# EAGLE design gamma (EAGLE 9.6.2)
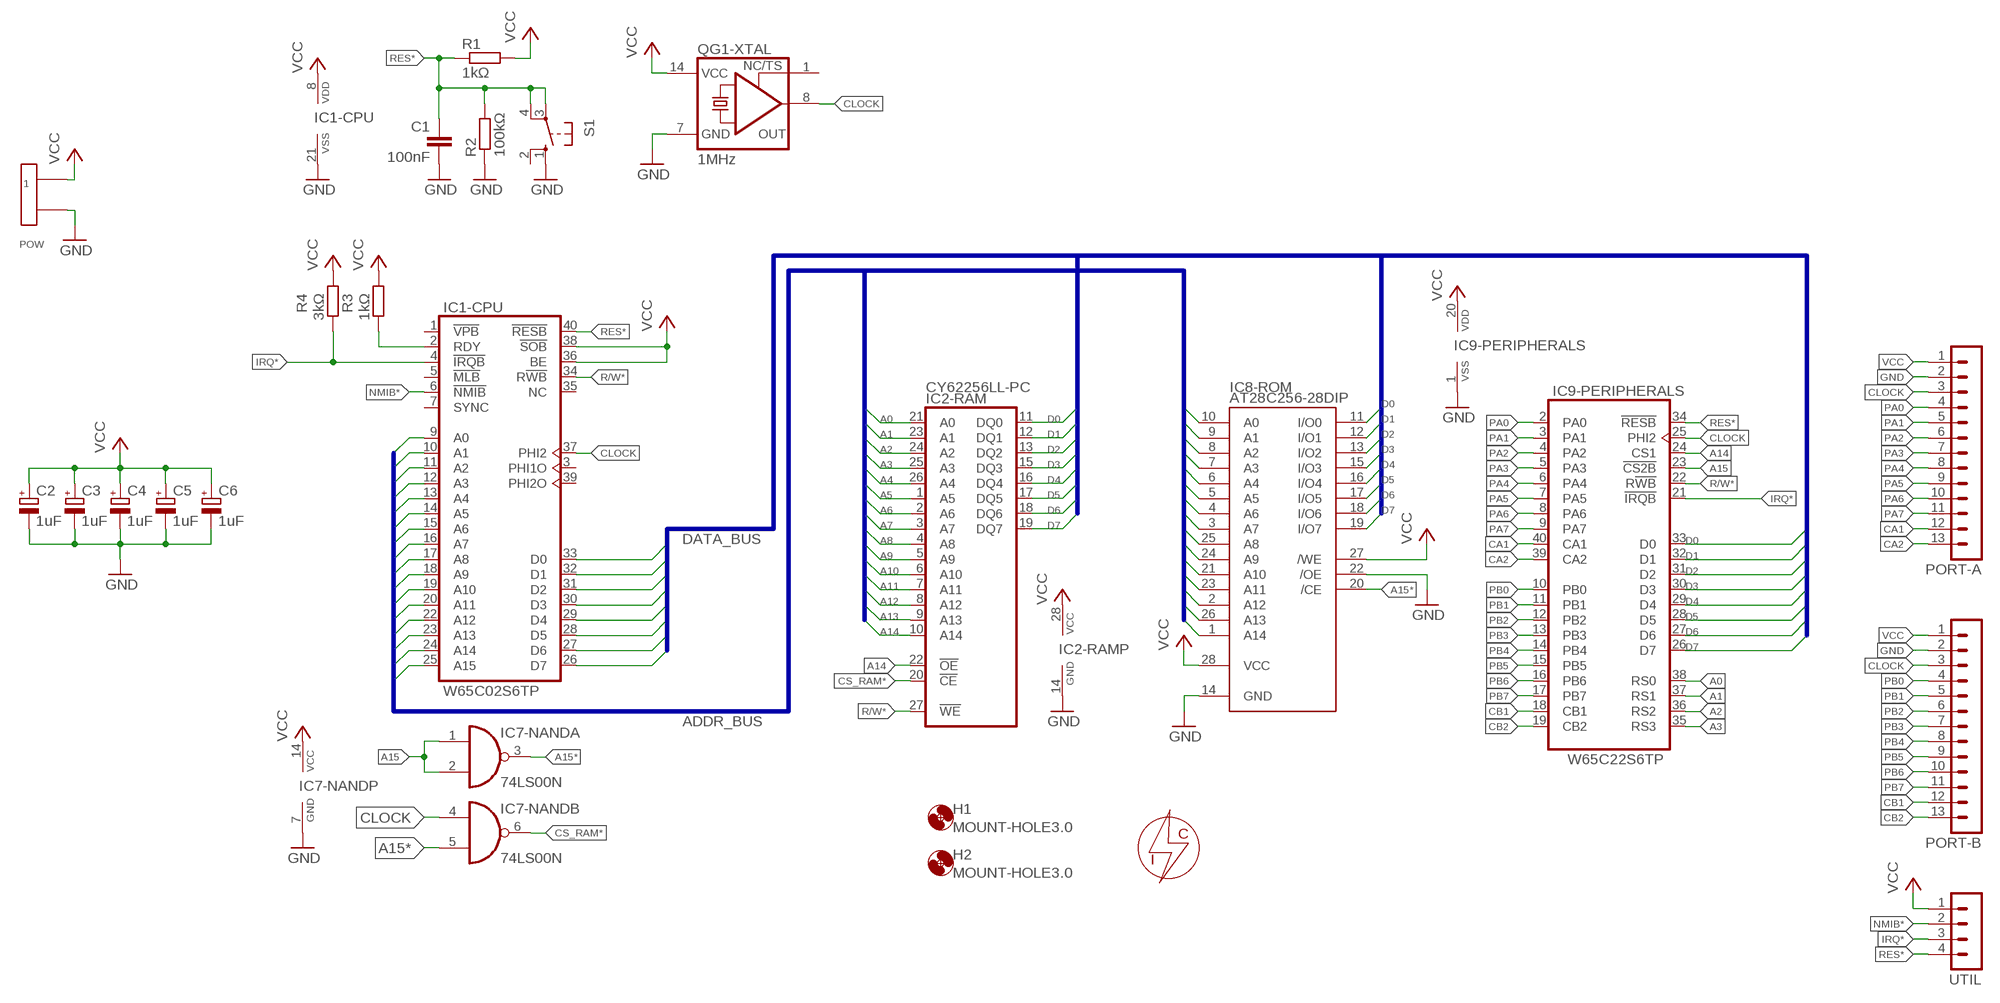
[diagram p0: schematic, sheet 1]

## Parts
C1  100nF  C-EU050-025X075  [C050-025X075]
C2  1uF  CPOL-EUE2-5  [E2-5]
C3  1uF  CPOL-EUE2-5  [E2-5]
C4  1uF  CPOL-EUE2-5  [E2-5]
C5  1uF  CPOL-EUE2-5  [E2-5]
C6  1uF  CPOL-EUE2-5  [E2-5]
H1  MOUNT-HOLE3.0  [3,0]
H2  MOUNT-HOLE3.0  [3,0]
IC1-CPU  W65C02S6TP  [DIL40]
IC2-RAM  CY62256LL-PC  [DIL28-6]
IC7-NAND  74LS00N  [DIL14]
IC8-ROM  AT28C256-28DIP  [DIL28-6]
IC9-PERIPHERALS  W65C22S6TP  [DIL40]
PORT-A  MA13-1  [MA13-1]
PORT-B  MA13-1  [MA13-1]
POW  AK500  [AK500-2]
QG1-XTAL  1MHz  XO-14  [DIL14S]
R1  1kΩ  R-EU_0207/10  [0207/10]
R2  100kΩ  R-EU_0207/10  [0207/10]
R3  1kΩ  R-EU_0207/10  [0207/10]
R4  3kΩ  R-EU_0207/10  [0207/10]
S1  10-XX  [B3F-10XX]
U$1  LOGO-CYBERINDUSTRIES"  [LOGO-SMALL]
UTIL  MA04-1  [MA04-1]

## Nets
A0: IC1-CPU.9(1:A0) IC2-RAM.21(A0) IC8-ROM.10(A0) IC9-PERIPHERALS.38(VIA:RS0)
A1: IC1-CPU.10(1:A1) IC2-RAM.23(A1) IC8-ROM.9(A1) IC9-PERIPHERALS.37(VIA:RS1)
A2: IC1-CPU.11(1:A2) IC2-RAM.24(A2) IC8-ROM.8(A2) IC9-PERIPHERALS.36(VIA:RS2)
A3: IC1-CPU.12(1:A3) IC2-RAM.25(A3) IC8-ROM.7(A3) IC9-PERIPHERALS.35(VIA:RS3)
A4: IC1-CPU.13(1:A4) IC2-RAM.26(A4) IC8-ROM.6(A4)
A5: IC1-CPU.14(1:A5) IC2-RAM.1(A5) IC8-ROM.5(A5)
A6: IC1-CPU.15(1:A6) IC2-RAM.2(A6) IC8-ROM.4(A6)
A7: IC1-CPU.16(1:A7) IC2-RAM.3(A7) IC8-ROM.3(A7)
A8: IC1-CPU.17(1:A8) IC2-RAM.4(A8) IC8-ROM.25(A8)
A9: IC1-CPU.18(1:A9) IC2-RAM.5(A9) IC8-ROM.24(A9)
A10: IC1-CPU.19(1:A10) IC2-RAM.6(A10) IC8-ROM.21(A10)
A11: IC1-CPU.20(1:A11) IC2-RAM.7(A11) IC8-ROM.23(A11)
A12: IC1-CPU.22(1:A12) IC2-RAM.8(A12) IC8-ROM.2(A12)
A13: IC1-CPU.23(1:A13) IC2-RAM.9(A13) IC8-ROM.26(A13)
A14: IC1-CPU.24(1:A14) IC2-RAM.10(A14) IC2-RAM.22(!OE) IC8-ROM.1(A14) IC9-PERIPHERALS.24(VIA:CS1)
A15: IC1-CPU.25(1:A15) IC7-NAND.1(A:I0) IC7-NAND.2(A:I1) IC9-PERIPHERALS.23(VIA:!CS2B)
A15*: IC7-NAND.3(A:O) IC7-NAND.5(B:I1) IC8-ROM.20(/CE)
CA1: IC9-PERIPHERALS.40(VIA:CA1) PORT-A.12
CA2: IC9-PERIPHERALS.39(VIA:CA2) PORT-A.13
CB1: IC9-PERIPHERALS.18(VIA:CB1) PORT-B.12
CB2: IC9-PERIPHERALS.19(VIA:CB2) PORT-B.13
CLOCK: IC1-CPU.37(1:PHI2) IC7-NAND.4(B:I0) IC9-PERIPHERALS.25(VIA:PHI2) PORT-A.3 PORT-B.3 QG1-XTAL.8(OUT)
CS_RAM*: IC2-RAM.20(!CE) IC7-NAND.6(B:O)
D0: IC1-CPU.33(1:D0) IC2-RAM.11(DQ0) IC8-ROM.11(I/O0) IC9-PERIPHERALS.33(VIA:D0)
D1: IC1-CPU.32(1:D1) IC2-RAM.12(DQ1) IC8-ROM.12(I/O1) IC9-PERIPHERALS.32(VIA:D1)
D2: IC1-CPU.31(1:D2) IC2-RAM.13(DQ2) IC8-ROM.13(I/O2) IC9-PERIPHERALS.31(VIA:D2)
D3: IC1-CPU.30(1:D3) IC2-RAM.15(DQ3) IC8-ROM.15(I/O3) IC9-PERIPHERALS.30(VIA:D3)
D4: IC1-CPU.29(1:D4) IC2-RAM.16(DQ4) IC8-ROM.16(I/O4) IC9-PERIPHERALS.29(VIA:D4)
D5: IC1-CPU.28(1:D5) IC2-RAM.17(DQ5) IC8-ROM.17(I/O5) IC9-PERIPHERALS.28(VIA:D5)
D6: IC1-CPU.27(1:D6) IC2-RAM.18(DQ6) IC8-ROM.18(I/O6) IC9-PERIPHERALS.27(VIA:D6)
D7: IC1-CPU.26(1:D7) IC2-RAM.19(DQ7) IC8-ROM.19(I/O7) IC9-PERIPHERALS.26(VIA:D7)
GND: C1.2 C2.- C3.- C4.- C5.- C6.- IC1-CPU.21(P:VSS) IC2-RAM.14(GND) IC7-NAND.7(P:GND) IC8-ROM.14(GND) IC8-ROM.22(/OE) IC9-PERIPHERALS.1(VIAP:VSS) PORT-A.2 PORT-B.2 POW.P$2 QG1-XTAL.7(GND) R2.1 S1.1(S)
IRQ*: IC1-CPU.4(1:!IRQB) IC9-PERIPHERALS.21(VIA:!IRQB) R4.2 UTIL.3
N$1: IC1-CPU.2(1:RDY) R3.2
NMIB*: IC1-CPU.6(1:!NMIB) UTIL.2
PA0: IC9-PERIPHERALS.2(VIA:PA0) PORT-A.4
PA1: IC9-PERIPHERALS.3(VIA:PA1) PORT-A.5
PA2: IC9-PERIPHERALS.4(VIA:PA2) PORT-A.6
PA3: IC9-PERIPHERALS.5(VIA:PA3) PORT-A.7
PA4: IC9-PERIPHERALS.6(VIA:PA4) PORT-A.8
PA5: IC9-PERIPHERALS.7(VIA:PA5) PORT-A.9
PA6: IC9-PERIPHERALS.8(VIA:PA6) PORT-A.10
PA7: IC9-PERIPHERALS.9(VIA:PA7) PORT-A.11
PB0: IC9-PERIPHERALS.10(VIA:PB0) PORT-B.4
PB1: IC9-PERIPHERALS.11(VIA:PB1) PORT-B.5
PB2: IC9-PERIPHERALS.12(VIA:PB2) PORT-B.6
PB3: IC9-PERIPHERALS.13(VIA:PB3) PORT-B.7
PB4: IC9-PERIPHERALS.14(VIA:PB4) PORT-B.8
PB5: IC9-PERIPHERALS.15(VIA:PB5) PORT-B.9
PB6: IC9-PERIPHERALS.16(VIA:PB6) PORT-B.10
PB7: IC9-PERIPHERALS.17(VIA:PB7) PORT-B.11
R/W*: IC1-CPU.34(1:R!WB) IC2-RAM.27(!WE) IC9-PERIPHERALS.22(VIA:R!WB)
RES*: C1.1 IC1-CPU.40(1:!RESB) IC9-PERIPHERALS.34(VIA:!RESB) R1.1 R2.2 S1.3(P) S1.4(P1) UTIL.4
VCC: C2.+ C3.+ C4.+ C5.+ C6.+ IC1-CPU.8(P:VDD) IC1-CPU.36(1:BE) IC1-CPU.38(1:!SOB) IC2-RAM.28(VCC) IC7-NAND.14(P:VCC) IC8-ROM.27(/WE) IC8-ROM.28(VCC) IC9-PERIPHERALS.20(VIAP:VDD) PORT-A.1 PORT-B.1 POW.P$1 QG1-XTAL.14(VCC) R1.2 R3.1 R4.1 UTIL.1
Unconnected: IC1-CPU.1(1:!VPB) IC1-CPU.3(1:PHI1O) IC1-CPU.5(1:!MLB) IC1-CPU.7(1:SYNC) IC1-CPU.35(1:NC) IC1-CPU.39(1:PHI2O) IC7-NAND.8(C:O) IC7-NAND.9(C:I0) IC7-NAND.10(C:I1) IC7-NAND.11(D:O) IC7-NAND.12(D:I0) IC7-NAND.13(D:I1) QG1-XTAL.1(TS) S1.2(S1)

## Buses
D0,D1,D2,D3,D4,D5,D6,D7
ADDR_BUS:A0,A1,A2,A3,A4,A5,A6,A7,A8,A9,A10,A11,A12,A13,A14,A15

## Notes on the sheet
- DATA_BUS
- ADDR_BUS

## Library data of the parts
C1 = rcl:C-EU: CAPACITOR, European symbol; SPICEPREFIX: C
C2-C6 = ITIS:CPOL-EU: POLARIZED CAPACITOR, European symbol
H1 H2 = ITIS:MOUNT-HOLE: MOUNTING HOLE with drill center marker
IC1-CPU = 6502:W65C02S: W65C02 by WDC
IC2-RAM = memory-sram:CY62256LL-?*: 256K (32K x 8) CMOS-Static RAM Source: http://download.cypress.com.edgesuite.net/design_resources/datasheets/contents/cy62256_8.pdf
IC7-NAND = 74xx-eu:74*00: Quad 2-input NAND gate
IC8-ROM = atmel-custom:AT28C256-28DIP: IC EEPROM 256KBIT 150NS 28DIP
IC9-PERIPHERALS = 6502:W65C22S: W65C22 by WDC
PORT-A PORT-B = con-lstb:MA13-1: PIN HEADER; OC_FARNELL: unknown; OC_NEWARK: unknown
POW = CiniTechLibrary:AK500
QG1-XTAL = crystal:XO-: CRYSTAL; OC_FARNELL: unknown; OC_NEWARK: unknown
R1-R4 = rcl:R-EU_: RESISTOR, European symbol; SPICEPREFIX: R
S1 = switch-omron:10-XX: OMRON SWITCH; MPN: B3F-1000; OC_FARNELL: 176432; OC_NEWARK: 36M3542
U$1 = CyberLibrary:LOGO-CYBERINDUSTRIES
UTIL = con-lstb:MA04-1: PIN HEADER; OC_FARNELL: unknown; OC_NEWARK: unknown

## Board
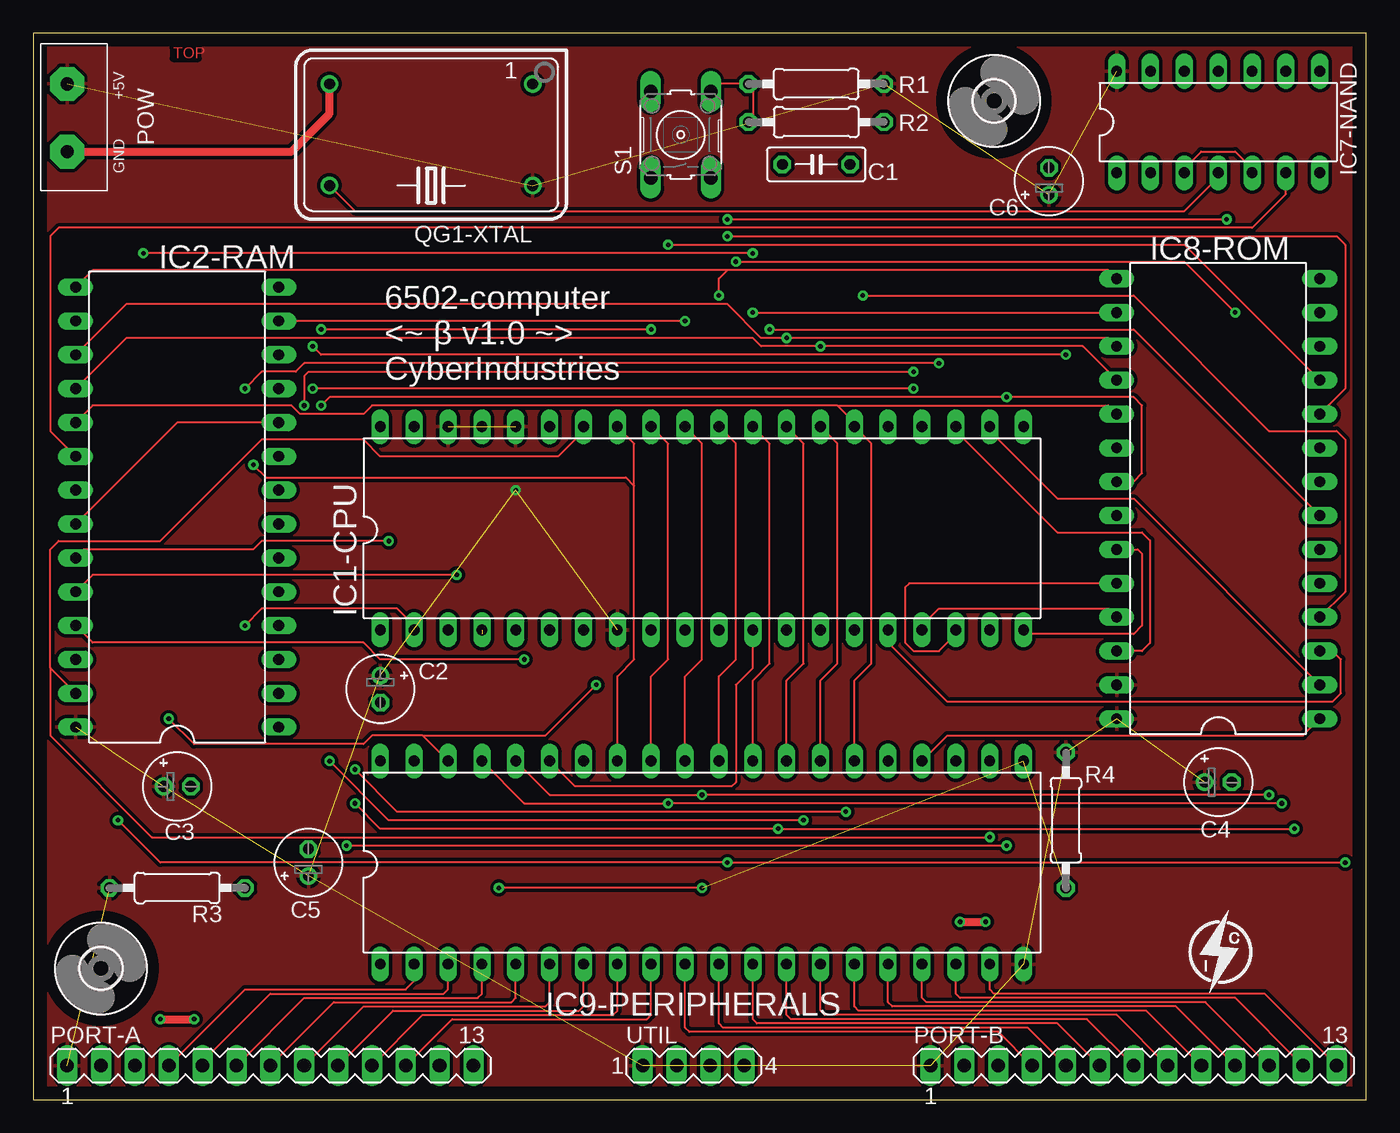
[diagram p1: board, top side]
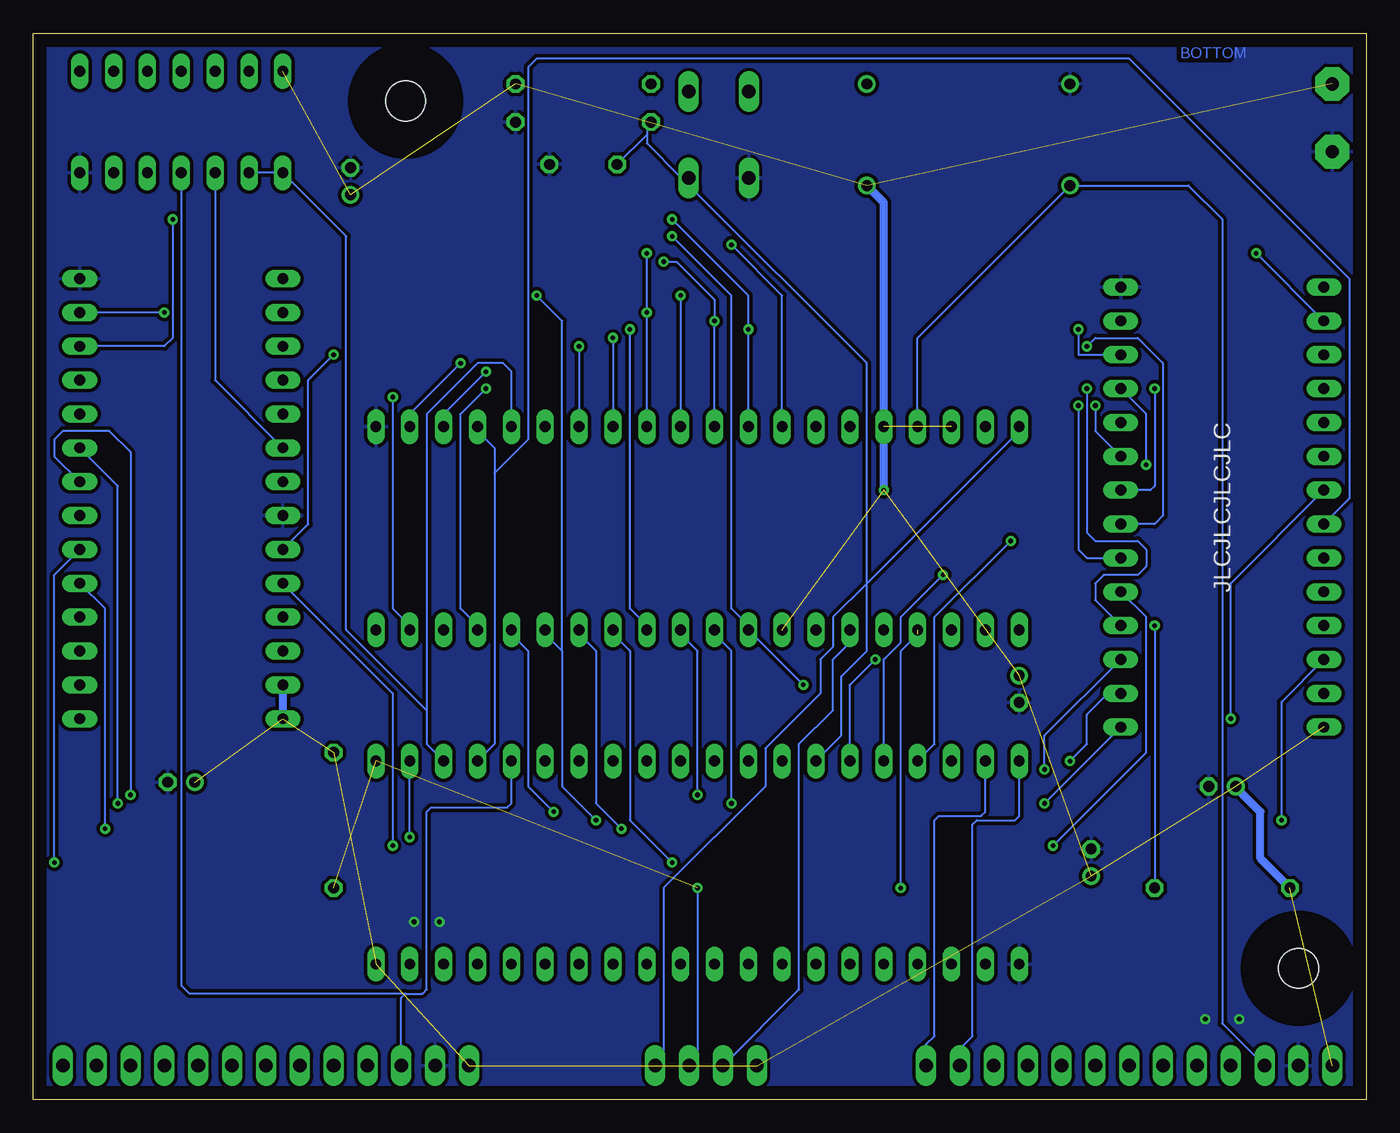
[diagram p2: board, bottom side, seen from below]

Size 100 x 80 mm. Coordinates in mm from the lower left corner, seen from the top.
Outline: 0,0 100,0 100,80 0,80 0,0
Copper layers (1*16): Top 0.035mm / dielectric 1.5mm / Bottom 0.035mm
Design rules "default": minimum track width 6mil, minimum drill 0.35mm, track to track 6mil, track to pad 6mil, pad to pad 6mil, via to via 6mil, smd to smd 6mil, copper to edge 40mil, drill to drill 6mil, minimum pad ring 10mil, minimum via ring 8mil, stop-mask expansion 4mil, vias tented up to drill 0mil, thermal gap 10mil

### Footprints (pad centres in the part's own frame; a part is rotated, then mirrored left to right if it is on the bottom)
C050-025X075 = drill 0.813 octagon: 1 -2.54,0; 2 2.54,0
E2-5 = drill 0.813 pad 1.27: + -1.016,0 | drill 0.813 pad 1.27 octagon: - 1.016,0
3,0 = hole 3: 0,0
DIL40 = drill 0.813 long: 1 -24.13,-7.62; 2 -21.59,-7.62; 3 -19.05,-7.62; 4 -16.51,-7.62; 5 -13.97,-7.62; 6 -11.43,-7.62; 7 -8.89,-7.62; 8 -6.35,-7.62; 9 -3.81,-7.62; 10 -1.27,-7.62; 11 1.27,-7.62; 12 3.81,-7.62; 13 6.35,-7.62; 14 8.89,-7.62; 15 11.43,-7.62; 16 13.97,-7.62; 17 16.51,-7.62; 18 19.05,-7.62; 19 21.59,-7.62; 20 24.13,-7.62; 21 24.13,7.62; 22 21.59,7.62; 23 19.05,7.62; 24 16.51,7.62; 25 13.97,7.62; 26 11.43,7.62; 27 8.89,7.62; 28 6.35,7.62; 29 3.81,7.62; 30 1.27,7.62; 31 -1.27,7.62; 32 -3.81,7.62; 33 -6.35,7.62; 34 -8.89,7.62; 35 -11.43,7.62; 36 -13.97,7.62; 37 -16.51,7.62; 38 -19.05,7.62; 39 -21.59,7.62; 40 -24.13,7.62
DIL28-6 = drill 0.813 long: 1 -16.51,-7.62; 2 -13.97,-7.62; 3 -11.43,-7.62; 4 -8.89,-7.62; 5 -6.35,-7.62; 6 -3.81,-7.62; 7 -1.27,-7.62; 8 1.27,-7.62; 9 3.81,-7.62; 10 6.35,-7.62; 11 8.89,-7.62; 12 11.43,-7.62; 13 13.97,-7.62; 14 16.51,-7.62; 15 16.51,7.62; 16 13.97,7.62; 17 11.43,7.62; 18 8.89,7.62; 19 6.35,7.62; 20 3.81,7.62; 21 1.27,7.62; 22 -1.27,7.62; 23 -3.81,7.62; 24 -6.35,7.62; 25 -8.89,7.62; 26 -11.43,7.62; 27 -13.97,7.62; 28 -16.51,7.62
DIL14 = drill 0.813 long: 1 -7.62,-3.81; 2 -5.08,-3.81; 3 -2.54,-3.81; 4 0,-3.81; 5 2.54,-3.81; 6 5.08,-3.81; 7 7.62,-3.81; 8 7.62,3.81; 9 5.08,3.81; 10 2.54,3.81; 11 0,3.81; 12 -2.54,3.81; 13 -5.08,3.81; 14 -7.62,3.81
MA13-1 = drill 1.016 long: 1 -15.24,0; 2 -12.7,0; 3 -10.16,0; 4 -7.62,0; 5 -5.08,0; 6 -2.54,0; 7 0,0; 8 2.54,0; 9 5.08,0; 10 7.62,0; 11 10.16,0; 12 12.7,0; 13 15.24,0
AK500-2 = drill 1 pad 2.54 octagon: P$1 0,0; P$2 5.08,0
DIL14S = drill 0.813: 1 -7.62,-3.81; 7 7.62,-3.81; 8 7.62,3.81; 14 -7.62,3.81
0207/10 = drill 0.813 octagon: 1 -5.08,0; 2 5.08,0
B3F-10XX = drill 1.016 long: 1 -3.251,2.261; 2 3.251,2.261; 3 -3.251,-2.261; 4 3.251,-2.261
MA04-1 = drill 1.016 long: 1 -3.81,0; 2 -1.27,0; 3 1.27,0; 4 3.81,0

### Placement (x,y rotation side)
C1  58.74,70.17 0 top
C2  26.04,30.8 270 top
C3  10.79,23.5 0 top
C4  88.9,23.81 0 top
C5  20.64,17.78 90 top
C6  76.2,68.9 90 top
H1  5.08,9.84 0 top
H2  72.07,74.93 0 top
IC1-CPU  50.16,42.86 0 top
IC2-RAM  10.79,44.45 90 top
IC7-NAND  88.9,73.34 0 top
IC8-ROM  88.9,45.09 90 top
IC9-PERIPHERALS  50.16,17.78 0 top
PORT-A  17.78,2.54 0 top
PORT-B  82.55,2.54 0 top
POW  2.54,76.2 270 top
QG1-XTAL  29.84,72.39 180 top
R1  58.74,76.2 0 top
R2  58.74,73.34 180 top
R3  10.79,15.88 0 top
R4  77.47,20.95 270 top
S1  48.58,72.39 90 top
U$1  86.68,7.94 0 top
UTIL  49.53,2.54 0 top

### Tracks (layer width: path | path; a pad name or v marks a point on that pad's centre or on a via)
A0  (via drill 0.35)
  Top 0.152: v10.16,28.57 12.06,26.67 24.77,26.67 25.4,27.3 29.21,27.3 | IC9-PERIPHERALS.38 29.21,27.3 | v42.23,31.11 38.42,27.3 29.21,27.3 | IC8-ROM.10 98.42,53.34 98.42,64.14 97.79,64.77 v52.07,64.77
  Bottom 0.152: IC2-RAM.21 10.16,38.73 v10.16,28.57 | v42.23,31.11 IC1-CPU.9 46.35,35.56 47.62,36.83 47.62,60.33 v52.07,64.77
A1  (via drill 0.35)
  Top 0.152: IC2-RAM.23 3.81,41.27 16.51,41.27 17.14,41.91 v26.67,41.91 | IC9-PERIPHERALS.37 36.83,22.23 v47.62,22.23 v93.66,22.23
  Bottom 0.152: v26.67,41.91 32.38,36.2 32.38,26.67 IC9-PERIPHERALS.37 | v47.62,22.23 47.62,33.66 48.9,34.92 IC1-CPU.10 | IC8-ROM.9 93.66,46.04 v93.66,22.23
A2  (via drill 0.35)
  Top 0.152: IC2-RAM.24 4.45,39.37 v31.75,39.37 | IC9-PERIPHERALS.36 38.73,22.86 v50.16,22.86 v92.71,22.86
  Bottom 0.152: v31.75,39.37 34.92,36.2 34.92,34.29 36.2,33.02 IC9-PERIPHERALS.36 | v50.16,22.86 50.16,33.66 51.44,34.92 IC1-CPU.11 | IC8-ROM.8 98.42,48.26 98.42,49.53 97.79,50.16 94.3,50.16 92.71,48.58 v92.71,22.86
A3  (via drill 0.35)
  Top 0.152: IC2-RAM.25 4.45,34.29 24.77,34.29 26.04,33.02 v36.83,33.02 | IC1-CPU.12 53.98,32.38 52.7,31.11 52.7,23.81 52.39,23.5 40.64,23.5 IC9-PERIPHERALS.35 | IC8-ROM.7 82.55,57.78 v55.24,57.78
  Bottom 0.152: v36.83,33.02 38.73,31.11 IC9-PERIPHERALS.35 | v55.24,57.78 55.24,36.83 53.98,35.56 IC1-CPU.12
A4  (via drill 0.35)
  Top 0.152: v6.35,20.95 9.53,17.78 v52.07,17.78 v98.42,17.78
  Bottom 0.152: IC2-RAM.26 6.35,29.84 v6.35,20.95 | v52.07,17.78 55.24,20.95 55.24,33.66 56.52,34.92 IC1-CPU.13 | IC8-ROM.6 98.42,39.37 v98.42,17.78
A5  (via drill 0.35)
  Top 0.152: v24.13,22.23 26.04,20.32 v55.88,20.32 v94.61,20.32
  Bottom 0.152: v24.13,22.23 IC2-RAM.1 | v55.88,20.32 57.78,22.23 57.78,33.66 59.05,34.92 IC1-CPU.14 | IC8-ROM.5 94.61,36.83 v94.61,20.32
A6  (via drill 0.35)
  Top 0.152: v22.23,25.4 26.67,20.95 v57.78,20.95 | IC8-ROM.4 98.42,38.1 98.42,49.53 97.79,50.16 92.71,50.16 82.55,60.33 v62.23,60.33
  Bottom 0.152: v57.78,20.95 60.33,23.5 60.33,33.66 | 60.33,33.66 61.59,34.92 IC1-CPU.15 | v62.23,60.33 60.33,58.42 60.33,33.66 | v22.23,25.4 20.95,26.67 20.95,28.89 19.37,30.48 IC2-RAM.2
A7  (via drill 0.35)
  Top 0.152: v24.13,24.77 27.3,21.59 v60.96,21.59 | IC1-CPU.16 64.14,34.29 68.58,29.84 97.47,29.84 98.11,30.48 98.11,33.02 97.47,33.66 IC8-ROM.3
  Bottom 0.152: IC2-RAM.3 24.13,27.3 v24.13,24.77 | v60.96,21.59 62.87,23.5 62.87,33.66 64.14,34.92 IC1-CPU.16
A8  (via drill 0.35)
  Top 0.152: v66.04,53.34 v20.95,53.34 | IC8-ROM.25 80.64,36.83 67.94,36.83 66.67,35.56 IC1-CPU.17
  Bottom 0.152: IC2-RAM.4 20.32,37.47 20.32,38.73 19.68,39.37 17.14,39.37 16.51,40.01 16.51,41.27 17.14,41.91 20.32,41.91 20.95,42.55 v20.95,53.34 | v66.04,53.34 67.94,51.44 67.94,36.83 66.67,35.56 IC1-CPU.17
A9  (via drill 0.35)
  Top 0.152: v73.03,19.05 v23.5,19.05 | IC8-ROM.24 65.72,38.73 65.41,38.42 65.41,34.29 66.04,33.66 67.94,33.66 69.22,34.92 IC1-CPU.18
  Bottom 0.152: IC2-RAM.5 16.51,36.2 16.51,26.04 v23.5,19.05 | v73.03,19.05 73.03,30.48 IC8-ROM.24
A10  (via drill 0.35)
  Top 0.152: v21.59,52.07 22.23,52.7 v73.03,52.7 82.55,52.7 83.19,52.07 83.19,46.99 82.55,46.35 IC8-ROM.21
  Bottom 0.152: IC2-RAM.6 20.95,40.64 21.59,41.27 v21.59,52.07 | v73.03,52.7 73.03,36.83 71.75,35.56 IC1-CPU.19
A11  (via drill 0.35)
  Top 0.152: v20.95,56.52 21.59,55.88 v77.47,55.88 | IC8-ROM.23 82.87,41.27 83.19,40.96 83.19,35.56 82.55,34.92 74.3,34.92 IC1-CPU.20
  Bottom 0.152: v20.95,56.52 20.32,57.15 17.14,57.15 15.24,55.24 15.24,43.81 15.88,43.18 IC2-RAM.7 | v77.47,55.88 79.38,53.98 79.38,43.18 IC8-ROM.23
A12  (via drill 0.35)
  Top 0.152: v15.88,53.34 17.14,54.61 19.68,54.61 20.32,55.24 v67.94,55.24 | IC8-ROM.2 82.55,45.09 76.83,45.09 71.75,50.16 IC1-CPU.22
  Bottom 0.152: IC2-RAM.8 16.19,45.72 15.88,46.04 v15.88,53.34 | v67.94,55.24 71.75,51.44 IC1-CPU.22
A13  (via drill 0.35)
  Top 0.152: v20.32,52.07 20.32,54.29 20.64,54.61 v66.04,54.61 | IC8-ROM.26 83.19,33.66 83.78,34.25 83.78,41.95 83.19,42.55 76.83,42.55 69.22,50.16 IC1-CPU.23
  Bottom 0.152: IC2-RAM.9 20.32,50.16 v20.32,52.07 | v66.04,54.61 69.22,51.44 IC1-CPU.23
A14
  Top 0.152: IC2-RAM.22 10.79,50.8 IC2-RAM.10 | IC8-ROM.1 95.25,27.3 68.58,27.3 IC9-PERIPHERALS.24
  Bottom 0.152: IC9-PERIPHERALS.24 65.41,26.67 65.41,46.99 | 65.41,46.99 65.41,48.9 66.67,50.16 IC1-CPU.24 | IC2-RAM.22 1.27,45.09 1.27,61.59 17.78,78.11 62.23,78.11 62.87,77.47 62.87,49.53 65.41,46.99
A15
  Bottom 0.152: IC9-PERIPHERALS.23 70.48,26.67 70.48,29.21 | 70.48,29.21 70.48,51.44 66.67,55.24 64.77,55.24 64.14,54.61 IC1-CPU.25 | 70.48,29.21 76.52,35.24 76.52,64.77 IC7-NAND.1 IC7-NAND.2
A15*
  Top 0.152: IC7-NAND.5 91.44,69.85 90.17,71.12 87.63,71.12 86.36,69.85 IC7-NAND.3
  Bottom 0.152: IC8-ROM.20 86.36,53.98 IC7-NAND.3
CA1
  Bottom 0.152: PORT-A.12 30.48,3.81 29.53,4.76 29.53,20.64 29.21,20.95 26.35,20.95 26.04,21.27 IC9-PERIPHERALS.40
CA2
  Bottom 0.152: PORT-A.13 33.02,4.13 32.38,4.76 32.38,20.95 32.07,21.27 28.89,21.27 28.57,21.59 IC9-PERIPHERALS.39
CB1
  Top 0.152: PORT-B.12 90.17,7.62 69.53,7.62 69.22,7.94 IC9-PERIPHERALS.18
CB2
  Top 0.152: PORT-B.13 92.39,7.94 72.07,7.94 71.75,8.26 IC9-PERIPHERALS.19
CLOCK
  Top 0.152: QG1-XTAL.8 24.13,66.67 86.36,66.67 88.9,69.22 IC7-NAND.4
  Bottom 0.152: PORT-B.3 72.39,7.62 72.07,7.94 | IC9-PERIPHERALS.25 64.14,22.23 64.45,21.91 70.17,21.91 70.48,21.59 70.48,8.26 70.8,7.94 72.07,7.94 | IC1-CPU.37 33.66,57.15 QG1-XTAL.8 13.34,68.58 10.79,66.04 10.79,5.71 PORT-A.3 | IC7-NAND.4 88.9,8.57 88.27,7.94 72.07,7.94
CS_RAM*
  Top 0.152: IC2-RAM.20 1.27,50.16 1.27,64.77 1.91,65.41 91.44,65.41 93.98,67.94 IC7-NAND.6
D0  (via drill 0.35)
  Top 0.152: IC9-PERIPHERALS.33 43.81,31.75 45.09,33.02 45.09,46.04 | 45.09,46.04 45.09,49.21 IC1-CPU.33 | IC8-ROM.11 86.36,64.14 v47.62,64.14 | 45.09,46.04 44.45,46.67 17.46,46.67 v16.51,47.62
  Bottom 0.152: IC2-RAM.11 16.51,51.44 v16.51,47.62 | v47.62,64.14 43.81,60.33 IC1-CPU.33
D1  (via drill 0.35)
  Top 0.152: IC9-PERIPHERALS.32 46.35,31.75 47.62,33.02 47.62,49.21 IC1-CPU.32 | v46.35,57.78 v21.59,57.78 | v52.07,66.04 v89.53,66.04
  Bottom 0.152: IC2-RAM.12 21.59,55.88 v21.59,57.78 | IC1-CPU.32 v46.35,57.78 46.35,60.33 v52.07,66.04 | v89.53,66.04 89.53,57.15 90.17,56.52 IC8-ROM.12
D2  (via drill 0.35)
  Top 0.152: IC9-PERIPHERALS.31 48.9,31.75 50.16,33.02 50.16,49.21 IC1-CPU.31 | v48.9,58.42 IC2-RAM.13 | v90.17,59.05 86.36,62.87 v52.7,62.87
  Bottom 0.152: IC1-CPU.31 v48.9,58.42 48.9,60.01 51.75,62.87 v52.7,62.87 | v90.17,59.05 IC8-ROM.13
D3  (via drill 0.35)
  Top 0.152: IC9-PERIPHERALS.30 51.44,31.75 52.7,33.02 52.7,49.21 IC1-CPU.30 | IC2-RAM.15 4.45,62.23 52.07,62.23 | 52.07,62.23 80.64,62.23 IC8-ROM.15 | v51.44,60.33 51.44,61.59 52.07,62.23
  Bottom 0.152: v51.44,60.33 IC1-CPU.30
D4  (via drill 0.35)
  Top 0.152: IC9-PERIPHERALS.29 53.98,31.43 55.24,32.7 55.24,49.21 IC1-CPU.29 | v53.98,63.5 v8.26,63.5 | v53.98,59.05 IC8-ROM.16
  Bottom 0.152: v8.26,63.5 IC2-RAM.16 | IC1-CPU.29 v53.98,59.05 v53.98,63.5
D5  (via drill 0.35)
  Top 0.152: IC9-PERIPHERALS.28 56.52,31.43 57.78,32.7 57.78,49.21 IC1-CPU.28 | IC2-RAM.17 6.99,59.69 52.07,59.69 54.61,57.15 v56.52,57.15 80.64,57.15 IC8-ROM.17
  Bottom 0.152: v56.52,57.15 IC1-CPU.28
D6  (via drill 0.35)
  Top 0.152: IC9-PERIPHERALS.27 59.05,31.43 60.33,32.7 60.33,49.21 IC1-CPU.27 | IC2-RAM.18 6.99,57.15 53.98,57.15 54.61,56.52 v59.05,56.52 78.74,56.52 IC8-ROM.18
  Bottom 0.152: v59.05,56.52 IC1-CPU.27
D7
  Top 0.152: IC9-PERIPHERALS.26 61.59,31.43 62.87,32.7 62.87,49.21 IC1-CPU.26 61.59,50.8 60.33,52.07 | IC2-RAM.19 4.45,52.07 19.37,52.07 20,51.44 24.77,51.44 25.4,52.07 60.33,52.07 | IC8-ROM.19 80.64,52.07 60.33,52.07
GND  (via drill 0.35)
  Top 0.61: POW.P$2 19.37,71.12 22.23,73.98 QG1-XTAL.7 | v69.53,13.34 v71.44,13.34 | v9.53,6.03 v12.06,6.03
  pour Bottom (isolate 0.254): 106.36,-4.45 -1.91,-4.45 -1.91,80.96 106.36,80.96
IRQ*  (via drill 0.35)  (3 unrouted)
  Top 0.152: v50.16,15.88 v34.92,15.88
  Bottom 0.152: 33.66,34.92 34.92,33.66 v34.92,15.88 | UTIL.3 50.16,3.17 v50.16,15.88
N$1  (via drill 0.35)
  Top 0.152: v15.88,35.56 17.14,36.83 27.3,36.83 28.57,35.56 IC1-CPU.2
  Bottom 0.152: v15.88,35.56 R3.2
NMIB*
  Bottom 0.152: UTIL.2 42.55,8.26 42.55,26.67 40.01,29.21 40.01,33.02 38.73,34.29 IC1-CPU.6
PA0
  Top 0.152: PORT-A.4 15.88,8.26 27.94,8.26 28.57,8.89 IC9-PERIPHERALS.2
PA1
  Top 0.152: PORT-A.5 12.7,2.86 17.78,7.94 30.8,7.94 31.11,8.26 IC9-PERIPHERALS.3
PA2
  Top 0.152: PORT-A.6 20.32,7.62 33.34,7.62 33.66,7.94 IC9-PERIPHERALS.4
PA3
  Top 0.152: PORT-A.7 22.54,7.3 35.88,7.3 36.2,7.62 IC9-PERIPHERALS.5
PA4
  Top 0.152: PORT-A.8 24.77,6.99 38.42,6.99 38.73,7.3 IC9-PERIPHERALS.6
PA5
  Top 0.152: PORT-A.9 26.99,6.67 40.96,6.67 41.27,6.99 IC9-PERIPHERALS.7
PA6
  Top 0.152: PORT-A.10 29.21,6.35 43.5,6.35 43.81,6.67 IC9-PERIPHERALS.8
PA7
  Top 0.152: PORT-A.11 31.43,6.03 46.04,6.03 46.35,6.35 IC9-PERIPHERALS.9
PB0
  Top 0.152: PORT-B.4 72.39,5.08 49.21,5.08 48.9,5.4 IC9-PERIPHERALS.10
PB1
  Top 0.152: PORT-B.5 74.61,5.4 51.75,5.4 51.44,5.71 IC9-PERIPHERALS.11
PB2
  Top 0.152: PORT-B.6 76.83,5.71 54.29,5.71 53.98,6.03 IC9-PERIPHERALS.12
PB3
  Top 0.152: PORT-B.7 79.06,6.03 56.83,6.03 56.52,6.35 IC9-PERIPHERALS.13
PB4
  Top 0.152: PORT-B.8 81.28,6.35 59.37,6.35 59.05,6.67 IC9-PERIPHERALS.14
PB5
  Top 0.152: PORT-B.9 83.5,6.67 61.91,6.67 61.59,6.99 IC9-PERIPHERALS.15
PB6
  Top 0.152: PORT-B.10 85.72,6.99 64.45,6.99 64.14,7.3 IC9-PERIPHERALS.16
PB7
  Top 0.152: PORT-B.11 87.95,7.3 66.99,7.3 66.67,7.62 IC9-PERIPHERALS.17
R/W*  (via drill 0.35)
  Top 0.152: 1.27,32.38 IC2-RAM.27 | 1.27,32.38 1.27,41.27 1.91,41.91 9.53,41.91 17.14,49.53 24.77,49.53 26.04,48.26 39.37,48.26 41.27,50.16 IC1-CPU.34 | v71.75,19.68 8.89,19.68 1.27,27.3 1.27,32.38
  Bottom 0.152: v71.75,19.68 IC9-PERIPHERALS.22
RES*
  Top 0.152: R2.2 53.98,73.66 53.98,76.2 R1.1 51.44,76.2 S1.4
  Bottom 0.152: 53.98,72.39 C1.1 | 53.98,72.39 53.98,73.03 R2.2 | 53.98,72.39 53.98,71.75 51.44,69.22 S1.3 50.8,68.58 37.47,55.24 37.47,38.73 | 37.47,38.73 26.04,50.16 IC1-CPU.40 | 37.47,38.73 37.47,33.66 39.37,31.75 39.37,27.3 IC9-PERIPHERALS.34 | UTIL.4 52.7,3.17 52.7,15.88 45.09,23.5 45.09,26.35 40.96,30.48 40.96,33.02 40.01,33.97 40.01,36.2 37.47,38.73
VCC  (via drill 0.35)  (17 unrouted)
  Bottom 0.61: R3.1 7.94,18.1 7.94,21.59 9.78,23.43 C3.+ | IC8-ROM.27 IC8-ROM.28 | QG1-XTAL.14 36.2,67.31 IC1-CPU.36 v36.2,45.72
  pour Top (isolate 0.254): -5.4,82.87 -5.4,-2.86 103.5,-2.86 103.5,82.87

### Text on the board
Top: TOP
Bottom: BOTTOM
tNames: +5V | GND | 6502-computer / <~ β v1.0 ~> / CyberIndustries
bNames: JLCJLCJLCJLC